# Altium schematic sheet [8] RJ45 Connector.SchDoc: ARS Camera REV01 USB and WiFi
size A4; DrawnBy: Manh Ngo Van; Engineer: Manh Ngo Van; Organization: Altium Limited; Address1: L3, 12a Rodborough Rd; Address2: Frenchs Forest; Address3: NSW; Address4: Australia 2086; DocumentNumber: 8; Revision: 1.0; SheetNumber: 8; SheetTotal: 16
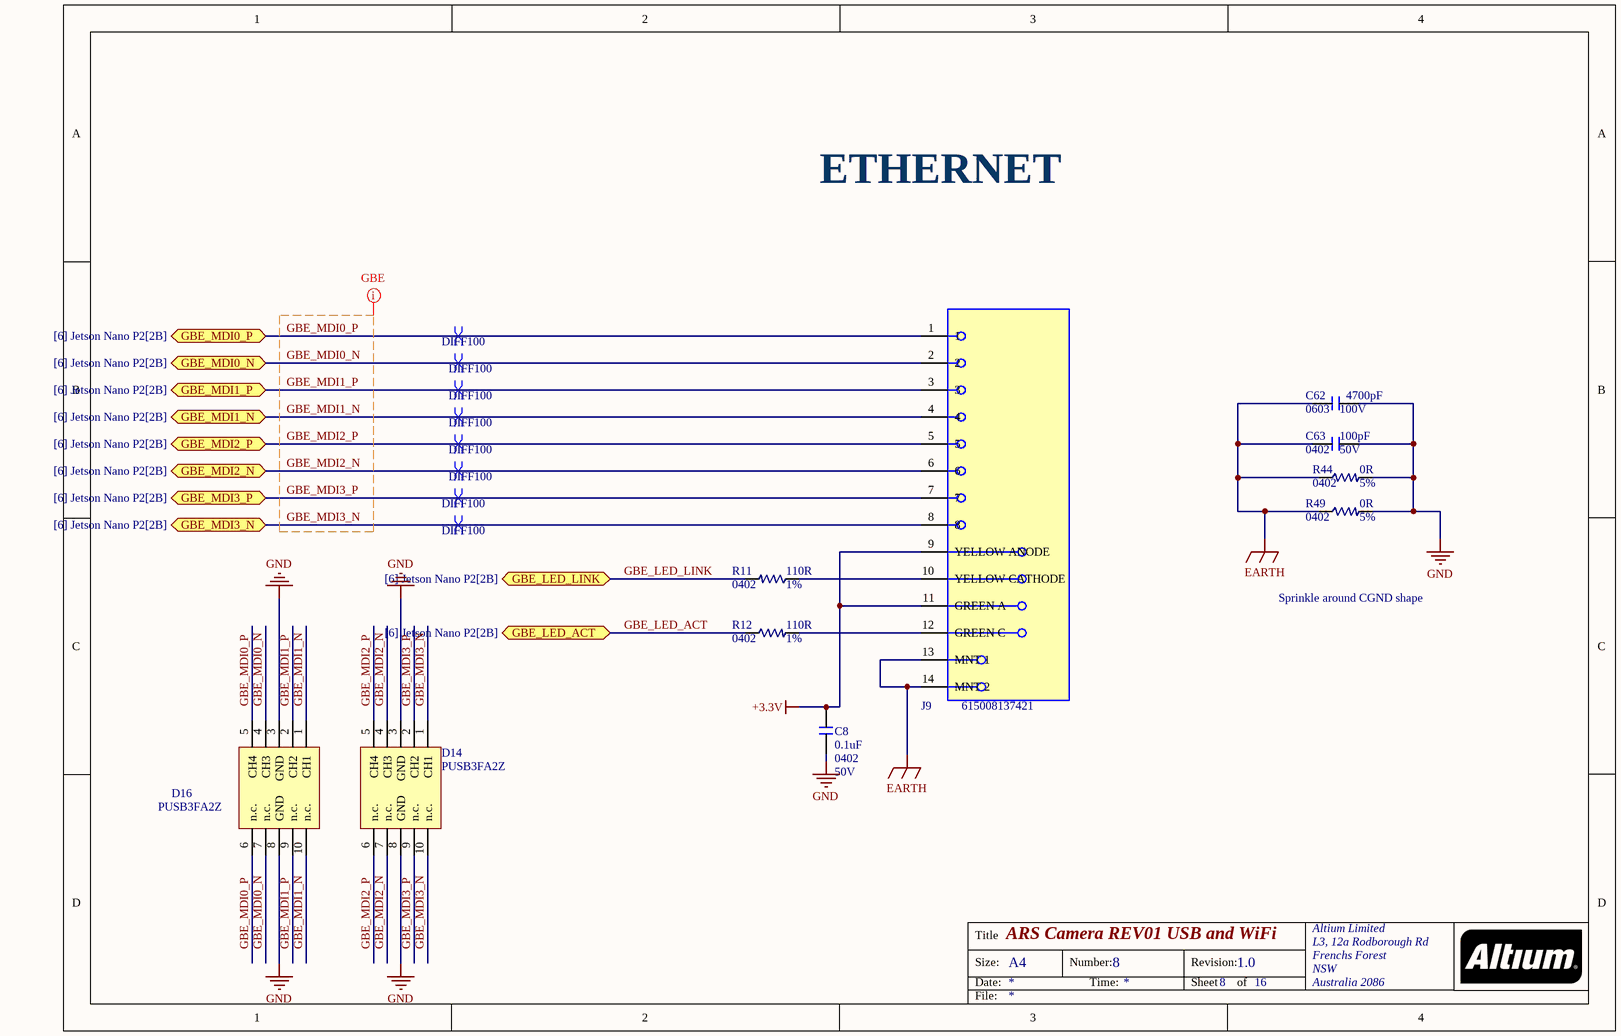
[diagram p0: [8] RJ45 Connector.SchDoc]

## Parts
C8  0.1uF  Case/Package: 0402  Voltage: 50V  [C0402M]
C62  4700pF  Case/Package: 0603  Voltage Rating: 100V  [C0603M]
C63  100pF  Case/Package: 0402  Voltage: 50V  [C0402M]
D14  PUSB3FA2Z  [SON50P100X50-10N]
D16  PUSB3FA2Z  [SON50P100X50-10N]
J9  615008137421  [Wurth_615008137421_MFG]
R11  110R  Case Code (Imperial): 0402  Tolerance: 1%  [R0402M]
R12  110R  Case Code (Imperial): 0402  Tolerance: 1%  [R0402M]
R44  0R  Case/Package: 0402  Resistance Tolerance: 5%  [R0402M]
R49  0R  Case/Package: 0402  Resistance Tolerance: 5%  [R0402M]

## Ports
GBE_LED_ACT (bidir, see [6] Jetson Nano P2[2B]), GBE_LED_LINK (bidir, see [6] Jetson Nano P2[2B]), GBE_MDI0_N (bidir, see [6] Jetson Nano P2[2B]), GBE_MDI0_P (bidir, see [6] Jetson Nano P2[2B]), GBE_MDI1_N (bidir, see [6] Jetson Nano P2[2B]), GBE_MDI1_P (bidir, see [6] Jetson Nano P2[2B]), GBE_MDI2_N (bidir, see [6] Jetson Nano P2[2B]), GBE_MDI2_P (bidir, see [6] Jetson Nano P2[2B]), GBE_MDI3_N (bidir, see [6] Jetson Nano P2[2B]), GBE_MDI3_P (bidir, see [6] Jetson Nano P2[2B])

## Nets
+3.3V: C8.2 J9.9(YELLOW_ANODE) J9.11(GREEN_A)
EARTH: C62.1 C63.2 J9.13(MNT_1) J9.14(MNT_2) R44.2 R49.2
GND: C8.1 C62.2 C63.1 D14.3(GND) D14.8(GND) D16.3(GND) D16.8(GND) R44.1 R49.1
GBE_LED_ACT: R12.2 ; port GBE_LED_ACT
GBE_LED_LINK: R11.1 ; port GBE_LED_LINK
GBE_MDI0_N: D16.4(CH3) D16.7(n.c.) J9.2 ; port GBE_MDI0_N
GBE_MDI0_P: D16.5(CH4) D16.6(n.c.) J9.1 ; port GBE_MDI0_P
GBE_MDI1_N: D16.1(CH1) D16.10(n.c.) J9.4 ; port GBE_MDI1_N
GBE_MDI1_P: D16.2(CH2) D16.9(n.c.) J9.3 ; port GBE_MDI1_P
GBE_MDI2_N: D14.4(CH3) D14.7(n.c.) J9.6 ; port GBE_MDI2_N
GBE_MDI2_P: D14.5(CH4) D14.6(n.c.) J9.5 ; port GBE_MDI2_P
GBE_MDI3_N: D14.1(CH1) D14.10(n.c.) J9.8 ; port GBE_MDI3_N
GBE_MDI3_P: D14.2(CH2) D14.9(n.c.) J9.7 ; port GBE_MDI3_P
NetJ9_10: J9.10(YELLOW_CATHODE) R11.2
NetJ9_12: J9.12(GREEN_C) R12.1

## Layout directives
differential pair; differential pair class DIFF100; net class DIFF100: GBE_MDI0_N, GBE_MDI0_P, GBE_MDI1_N, GBE_MDI1_P, GBE_MDI2_N, GBE_MDI2_P, GBE_MDI3_N, GBE_MDI3_P
net class GBE; rule Matched Net Lengths [Tolerance = 20mil]: GBE_MDI0_N, GBE_MDI0_P, GBE_MDI1_N, GBE_MDI1_P, GBE_MDI2_N, GBE_MDI2_P, GBE_MDI3_N, GBE_MDI3_P

## Notes on the sheet
- ETHERNET
- Sprinkle around CGND shape
- Title
- Size:
- Date:
- A4
- Number:
- Time:
- Revision:
- Sheet
- of
- File:

## Library data of the parts
C8 = CAP_CER: CAP CER 0.1UF 50V X7R 0402; Manufacturer: Murata; Manufacturer Part Number: GRM155R71H104KE14D; Material: Ceramic; Tolerance: 10%; Capacitance: 100nF; Dissipation Factor: 0.025%; ComponentLink1URL: https://datasheet.ciiva.com/25741/cl10b104kb8nnnl-25741341.pdf?src-supplier=Digi-Key; ComponentLink1Description: https://datasheet.ciiva.com/25741/cl10b104kb8nnnl-25741341.pdf?src-supplier=Digi-Key; ComponentLink2URL: https://datasheet.ciiva.com/26838/getdatasheetpartid-357523-26838415.pdf?src-supplier=Verical; ComponentLink2Description: https://datasheet.ciiva.com/26838/getdatasheetpartid-357523-26838415.pdf?src-supplier=Verical; Supplier 1: Digi-Key; Supplier Part Number 1: 490-10700-1-ND; Stock 1: 2282266; Pricing 1: 1 = 0.10000, 10 = 0.04600, 100 = 0.02050, 500 = 0.01464, 1000 = 0.01150, 2500 = 0.01045, 5000 = 0.00961 (USD); RoHS: Yes; Mount: Surface Mount; Weight: 0.000212oz; Case Code (Metric): 1005; Case Code (Imperial): 0402; Dielectric Material: Ceramic; Min Operating Temperature: -55°C; Max Operating Temperature: 125°C; Packaging: Tape and Reel; Dielectric: X7R; Voltage Rating: 50V; Termination: SMD/SMT; Composition: Ceramic; Voltage Rating (DC): 50V; Package Quantity: 10000; Length: 1mm; Height: 0.5mm; Width: 0.5mm; Thickness: 0.022inch; Depth: 0.5mm; REACH SVHC: No SVHC; Lead Free: Lead Free; ComponentLink3URL: http://www.farnell.com/datasheets/2079156.pdf?src-supplier=Farnell; ComponentLink3Description: http://www.farnell.com/datasheets/2079156.pdf?src-supplier=Farnell; ComponentLink4URL: http://www.mouser.com/ds/2/281/c02e-2905.pdf?src-supplier=Mouser; ComponentLink4Description: http://www.mouser.com/ds/2/281/c02e-2905.pdf?src-supplier=Mouser; ComponentLink5URL: http://components.arrow.com/part/dataview/0323_07030614?src-supplier=Arrow+Europe; ComponentLink5Description: http://components.arrow.com/part/dataview/0323_07030614?src-supplier=Arrow+Europe; ComponentLink6URL: https://search.murata.co.jp/Ceramy/image/img/A01X/G101/ENG/GRM155R71H104KE14-01.pdf?src-supplier=Digi-Key; ComponentLink6Description: https://search.murata.co.jp/Ceramy/image/img/A01X/G101/ENG/GRM155R71H104KE14-01.pdf?src-supplier=Digi-Key; ComponentLink7URL: http://psearch.en.murata.com/capacitor/product/GRM155R71H104KE14%23.pdf?src-supplier=Avnet; ComponentLink7Description: http://psearch.en.murata.com/capacitor/product/GRM155R71H104KE14%23.pdf?src-supplier=Avnet; ComponentLink8URL: http://www.farnell.com/datasheets/2079156.pdf?src-supplier=Element14; ComponentLink8Description: http://www.farnell.com/datasheets/2079156.pdf?src-supplier=Element14; ComponentLink9URL: http://www.farnell.com/datasheets/2079156.pdf?src-supplier=Newark; ComponentLink9Description: http://www.farnell.com/datasheets/2079156.pdf?src-supplier=Newark
C62 = CAP_CER: CAP CER 4700PF 100V X7R 0603; Manufacturer 1: TDK; Manufacturer Part Number 1: CGA3E2X7R2A472K080AA; Mouting Technology: SMT; Capacitance: 4.7nF; Tolerance: 10%; Pin: 2; Supplier 1: Digi-Key; Supplier Part Number 1: 445-5810-1-ND; RoHS: Yes; Category: Ceramic Capacitors; Stock 1: 81816; Pricing 1: 1=0.10000, 10=0.06700, 50=0.03640, 100=0.02960, 500=0.02118, 1000=0.01664 (USD); Mount: Surface Mount; Case Code (Metric): 1608; Case Code (Imperial): 0603; Weight: 7.1E-05oz; Min Operating Temperature: -55°C; Max Operating Temperature: 125°C; Packaging: Tape and Reel; Voltage Rating (DC): 100V; Dielectric: X7R; Termination: SMD/SMT; Series: CGA; Package Quantity: 1; Resistor Type: Ceramic; Length: 1.6mm; Width: 0.031inch; Height: 0.8mm; Depth: 0.8mm; Thickness: 0.035inch; Ratings: AEC-Q200; RoHS Compliant: Yes; REACH SVHC: No SVHC; ComponentLink1URL: https://datasheet.ciiva.com/24218/cga3e2x7r2a472k080aa-266293-24218782.pdf?src-supplier=Mouser; ComponentLink1Description: https://datasheet.ciiva.com/24218/cga3e2x7r2a472k080aa-266293-24218782.pdf?src-supplier=Mouser; ComponentLink2URL: https://datasheet.ciiva.com/7975/1807242-7975353.pdf?src-supplier=Element14; ComponentLink2Description: https://datasheet.ciiva.com/7975/1807242-7975353.pdf?src-supplier=Element14
C63 = CAP_CER: CAP CER 100PF 50V C0G/NP0 0402; Manufacturer: Murata; Manufacturer Part Number: GRM1555C1H101JA01J; Tolerance: 5%; Dielectric: C0G; ComponentLink1URL: https://datasheet.ciiva.com/11786/0900766b80ef921d-11786069.pdf?src-supplier=RSComponents; ComponentLink1Description: https://datasheet.ciiva.com/11786/0900766b80ef921d-11786069.pdf?src-supplier=RSComponents; ComponentLink2URL: https://datasheet.ciiva.com/18184/getdatasheetpartid-199957-18184175.pdf?src-supplier=Verical; ComponentLink2Description: https://datasheet.ciiva.com/18184/getdatasheetpartid-199957-18184175.pdf?src-supplier=Verical; ComponentLink3URL: https://datasheet.ciiva.com/29200/453557-da-01-en-vs-kondensator-0402-29200111.pdf?src-supplier=Conrad; ComponentLink3Description: https://datasheet.ciiva.com/29200/453557-da-01-en-vs-kondensator-0402-29200111.pdf?src-supplier=Conrad; ComponentLink4URL: https://datasheet.ciiva.com/16440/product-16440566.pdf?src-supplier=Future+Electronics; ComponentLink4Description: https://datasheet.ciiva.com/16440/product-16440566.pdf?src-supplier=Future+Electronics; ComponentLink5URL: https://datasheet.ciiva.com/6271/partnumbering-e-01-6271071.pdf?src-supplier=Digi-Key; ComponentLink5Description: https://datasheet.ciiva.com/6271/partnumbering-e-01-6271071.pdf?src-supplier=Digi-Key; ComponentLink6URL: https://datasheet.ciiva.com/29541/partnumbering-e-01-29541637.pdf?src-supplier=Digi-Key; ComponentLink6Description: https://datasheet.ciiva.com/29541/partnumbering-e-01-29541637.pdf?src-supplier=Digi-Key; Supplier 1: Digi-Key; Supplier Part Number 1: 490-7754-1-ND; Stock 1: 869107; Pricing 1: 1 = 0.10000, 10 = 0.03700, 50 = 0.02040, 100 = 0.01660, 500 = 0.01186, 1000 = 0.00932, 2500 = 0.00847, 5000 = 0.00779 (USD); RoHS: Yes; Mount: Surface Mount; Case Code (Imperial): 0402; Case Code (Metric): 1005; Min Operating Temperature: -55°C; Max Operating Temperature: 125°C; Voltage Rating: 50V; Capacitance: 100pF; Voltage Rating (DC): 50V; Packaging: Tape and Reel; Package Quantity: 50000; Termination: SMD/SMT; Length: 1mm; Height: 0.5mm; Width: 0.5mm; Thickness: 0.022inch; Depth: 0.5mm; Radiation Hardening: No; Lead Free: Lead Free; ComponentLink7URL: https://datasheet.ciiva.com/5437/product-5437730.pdf?src-supplier=Mouser; ComponentLink7Description: https://datasheet.ciiva.com/5437/product-5437730.pdf?src-supplier=Mouser; ComponentLink8URL: https://datasheet.ciiva.com/29534/partnumbering-e-01-29534039.pdf?src-supplier=Digi-Key; ComponentLink8Description: https://datasheet.ciiva.com/29534/partnumbering-e-01-29534039.pdf?src-supplier=Digi-Key; ComponentLink9URL: https://datasheet.ciiva.com/11605/product-11605752.pdf?src-supplier=Avnet; ComponentLink9Description: https://datasheet.ciiva.com/11605/product-11605752.pdf?src-supplier=Avnet; ComponentLink10URL: https://datasheet.ciiva.com/29534/partnumbering-e-01-29534040.pdf?src-supplier=Digi-Key; ComponentLink10Description: https://datasheet.ciiva.com/29534/partnumbering-e-01-29534040.pdf?src-supplier=Digi-Key; ComponentLink11URL: https://datasheet.ciiva.com/29534/partnumbering-e-01-29534041.pdf?src-supplier=Digi-Key; ComponentLink11Description: https://datasheet.ciiva.com/29534/partnumbering-e-01-29534041.pdf?src-supplier=Digi-Key
D14 D16 = PUSB3FA2Z: ESD Suppressors / TVS Diodes PUSB3FA2 XSON10; Manufacturer 1: Nexperia; Supplier 1: Digi-Key; Manufacturer Part Number 1: PUSB3FA2Z; RoHS: No; Stock 1: 355; Pricing 1: 1=0.33000, 10=0.25600, 100=0.15390, 500=0.14250, 1000=0.09690, 2000=0.08921 (USD); ComponentLink1URL: https://assets.nexperia.com/documents/data-sheet/PUSB3FA2.pdf?src-supplier=Digi-Key; ComponentLink1Description: https://assets.nexperia.com/documents/data-sheet/PUSB3FA2.pdf?src-supplier=Digi-Key; Supplier Part Number 1: 1727-7813-1-ND
J9 = 615008137421: Modular Jack WR-MJ, Tab Up, Shielded, with LED and EMI Panel Finger, Horizontal Entry, THT, 8P8C; Manufacturer 1: Wurth Electronics; Connector Type: Jack,RJ45; Number of Positions: 8; Number of Ports: 1; Current Rating: 1.5A; Mating Cycles: 500; Gender: Female; Voltage Rating (AC): 120V; Insulation Resistance: 500MR; Supplier 1: RSComponents; Supplier Part Number 1: 7350298; Manufacturer Part Number 1: 615008137421; Stock 1: 919; Pricing 1: 1=2.93900, 15=2.64400, 50=2.44300, 250=2.13400 (USD); RoHS: Yes; Mount: Through Hole,PCB; Contact Plating: Gold,Tin; Contact Material: Copper Alloy; Housing Material: PBT; Color: Black,Green,Yellow; Min Operating Temperature: -40°C; Max Operating Temperature: 85°C; Shielding: Shielded; Packaging: Tray; Package Quantity: 60; Number of Rows: 1; Termination: Through Hole; Direction: Up; Number of Contacts: 8; Orientation: Right Angle; Series: WR-MJ; Length: 13.46mm; Width: 16.25mm; Height: 16.93mm; Depth: 15.75mm; RoHS Compliant: Yes; REACH SVHC: Unknown; Flammability Rating: UL94 V-0; ComponentLink1URL: https://datasheet.ciiva.com/6913/76606-6913951.pdf?src-supplier=Newark; ComponentLink1Description: https://datasheet.ciiva.com/6913/76606-6913951.pdf?src-supplier=Newark; ComponentLink2URL: https://datasheet.ciiva.com/4561/615008137421-71402-4561624.pdf?src-supplier=Mouser; ComponentLink2Description: https://datasheet.ciiva.com/4561/615008137421-71402-4561624.pdf?src-supplier=Mouser; ComponentLink3URL: https://datasheet.ciiva.com/686/615008137421-686729.pdf?src-supplier=Digi-Key; ComponentLink3Description: https://datasheet.ciiva.com/686/615008137421-686729.pdf?src-supplier=Digi-Key; ComponentLink4URL: https://datasheet.ciiva.com/11726/0900766b80f88673-11726176.pdf?src-supplier=RSComponents; ComponentLink4Description: https://datasheet.ciiva.com/11726/0900766b80f88673-11726176.pdf?src-supplier=RSComponents; ComponentLink5URL: https://datasheet.ciiva.com/48689/001088215-da-01-en-wr-com-modular-jack-615008137421-48689541.pdf?src-supplier=Conrad; ComponentLink5Description: https://datasheet.ciiva.com/48689/001088215-da-01-en-wr-com-modular-jack-615008137421-48689541.pdf?src-supplier=Conrad
R11 R12 = RES_SMD: RES SMD 110 OHM 1% 1/16W 0402; Manufacturer 1: Yageo; Manufacturer Part Number 1: RC0402FR-07110RL; Mouting Technology: SMT; Power Rating: 63mW; Voltage Rating: 50V; Temperature Coefficient: 100ppm/°C; Pin: 2; Supplier 1: Digi-Key; Supplier Part Number 1: 311-110LRCT-ND; RoHS: Yes; Category: Chip SMD Resistors; Stock 1: 182858; Pricing 1: 1=0.10000, 10=0.01600, 100=0.00660, 1000=0.00299, 2500=0.00259, 5000=0.00214 (USD); Case/Package: 0402; Number of Pins: 2; Case Code (Metric): 1005; Weight: 2.3E-05oz; Size Code: 0402; Min Operating Temperature: -55°C; Max Operating Temperature: 155°C; Resistance: 110R; Packaging: Tape and Reel; Resistor Type: Thick Film; Termination: SMD/SMT; Voltage Rating (DC): 50V; Features: Moisture Resistant; Series: RC; Max Power Dissipation: 63mW; Number of Terminations: 2; Resistance Tolerance: 1%; Construction: Rectangular; Length: 1mm; Width: 0.5mm; Height: 0.35mm; Depth: 0.5mm; REACH SVHC: No SVHC; Military Standard: Not; Lead Free: Lead Free; RoHS Compliant: Yes; ComponentLink1URL: https://datasheet.ciiva.com/12577/pyu-rc0402-51-rohs-l-6-r-12577287.pdf?src-supplier=Mouser; ComponentLink1Description: https://datasheet.ciiva.com/12577/pyu-rc0402-51-rohs-l-6-r-12577287.pdf?src-supplier=Mouser; ComponentLink2URL: https://datasheet.ciiva.com/17070/pyu-rc0402-51-rohs-l-6-r-17070361.pdf?src-supplier=Future+Electronics; ComponentLink2Description: https://datasheet.ciiva.com/17070/pyu-rc0402-51-rohs-l-6-r-17070361.pdf?src-supplier=Future+Electronics; ComponentLink3URL: https://datasheet.ciiva.com/15189/getdatasheetpartid-325087-15189341.pdf?src-supplier=Verical; ComponentLink3Description: https://datasheet.ciiva.com/15189/getdatasheetpartid-325087-15189341.pdf?src-supplier=Verical; ComponentLink4URL: https://datasheet.ciiva.com/7849/1018594-7849822.pdf?src-supplier=Element14; ComponentLink4Description: https://datasheet.ciiva.com/7849/1018594-7849822.pdf?src-supplier=Element14; ComponentLink5URL: https://datasheet.ciiva.com/7849/1018594-7849823.pdf?src-supplier=Element14; ComponentLink5Description: https://datasheet.ciiva.com/7849/1018594-7849823.pdf?src-supplier=Element14
R44 R49 = RES_SMD: YAGEO - RC0402JR-070RL. - RES, THICK FILM, 0R, 0.0625W, 0402; Mouting Technology: SMT; Resistance: 0mR; Power Rating: 62.5mW; Max Power Dissipation: 63mW; Voltage Rating: 50V; Temperature Coefficient: 200ppm/°C; Pin: 2; Supplier 1: RSComponents; Supplier Part Number 1: 6185804; Manufacturer 1: Yageo; Manufacturer Part Number 1: RC0402JR-070RL; Stock 1: 3830000; Pricing 1: 10000=0.00100, 10000=0.00100 (USD); RoHS: Yes; Contact Plating: Tin,Matte; Case Code (Metric): 1005; Case Code (Imperial): 0402; Size Code: 0402; Min Operating Temperature: -55°C; Max Operating Temperature: 155°C; Resistor Type: Thick Film; Packaging: Tape and Reel; Tolerance: 5%; Number of Terminations: 2; Features: Moisture Resistant; Termination: SMD/SMT; Series: RC; Package Quantity: 1; Technology: THICK FILM; Construction: Rectangular; Length: 1mm; Width: 0.02inch; Height: 0.016inch; Depth: 0.5mm; Radiation Hardening: No; RoHS Compliant: Yes; Lead Free: Lead Free; REACH SVHC: Unknown; Military Standard: Not